# EAGLE design ospi_v14 (EAGLE 6.5.0)
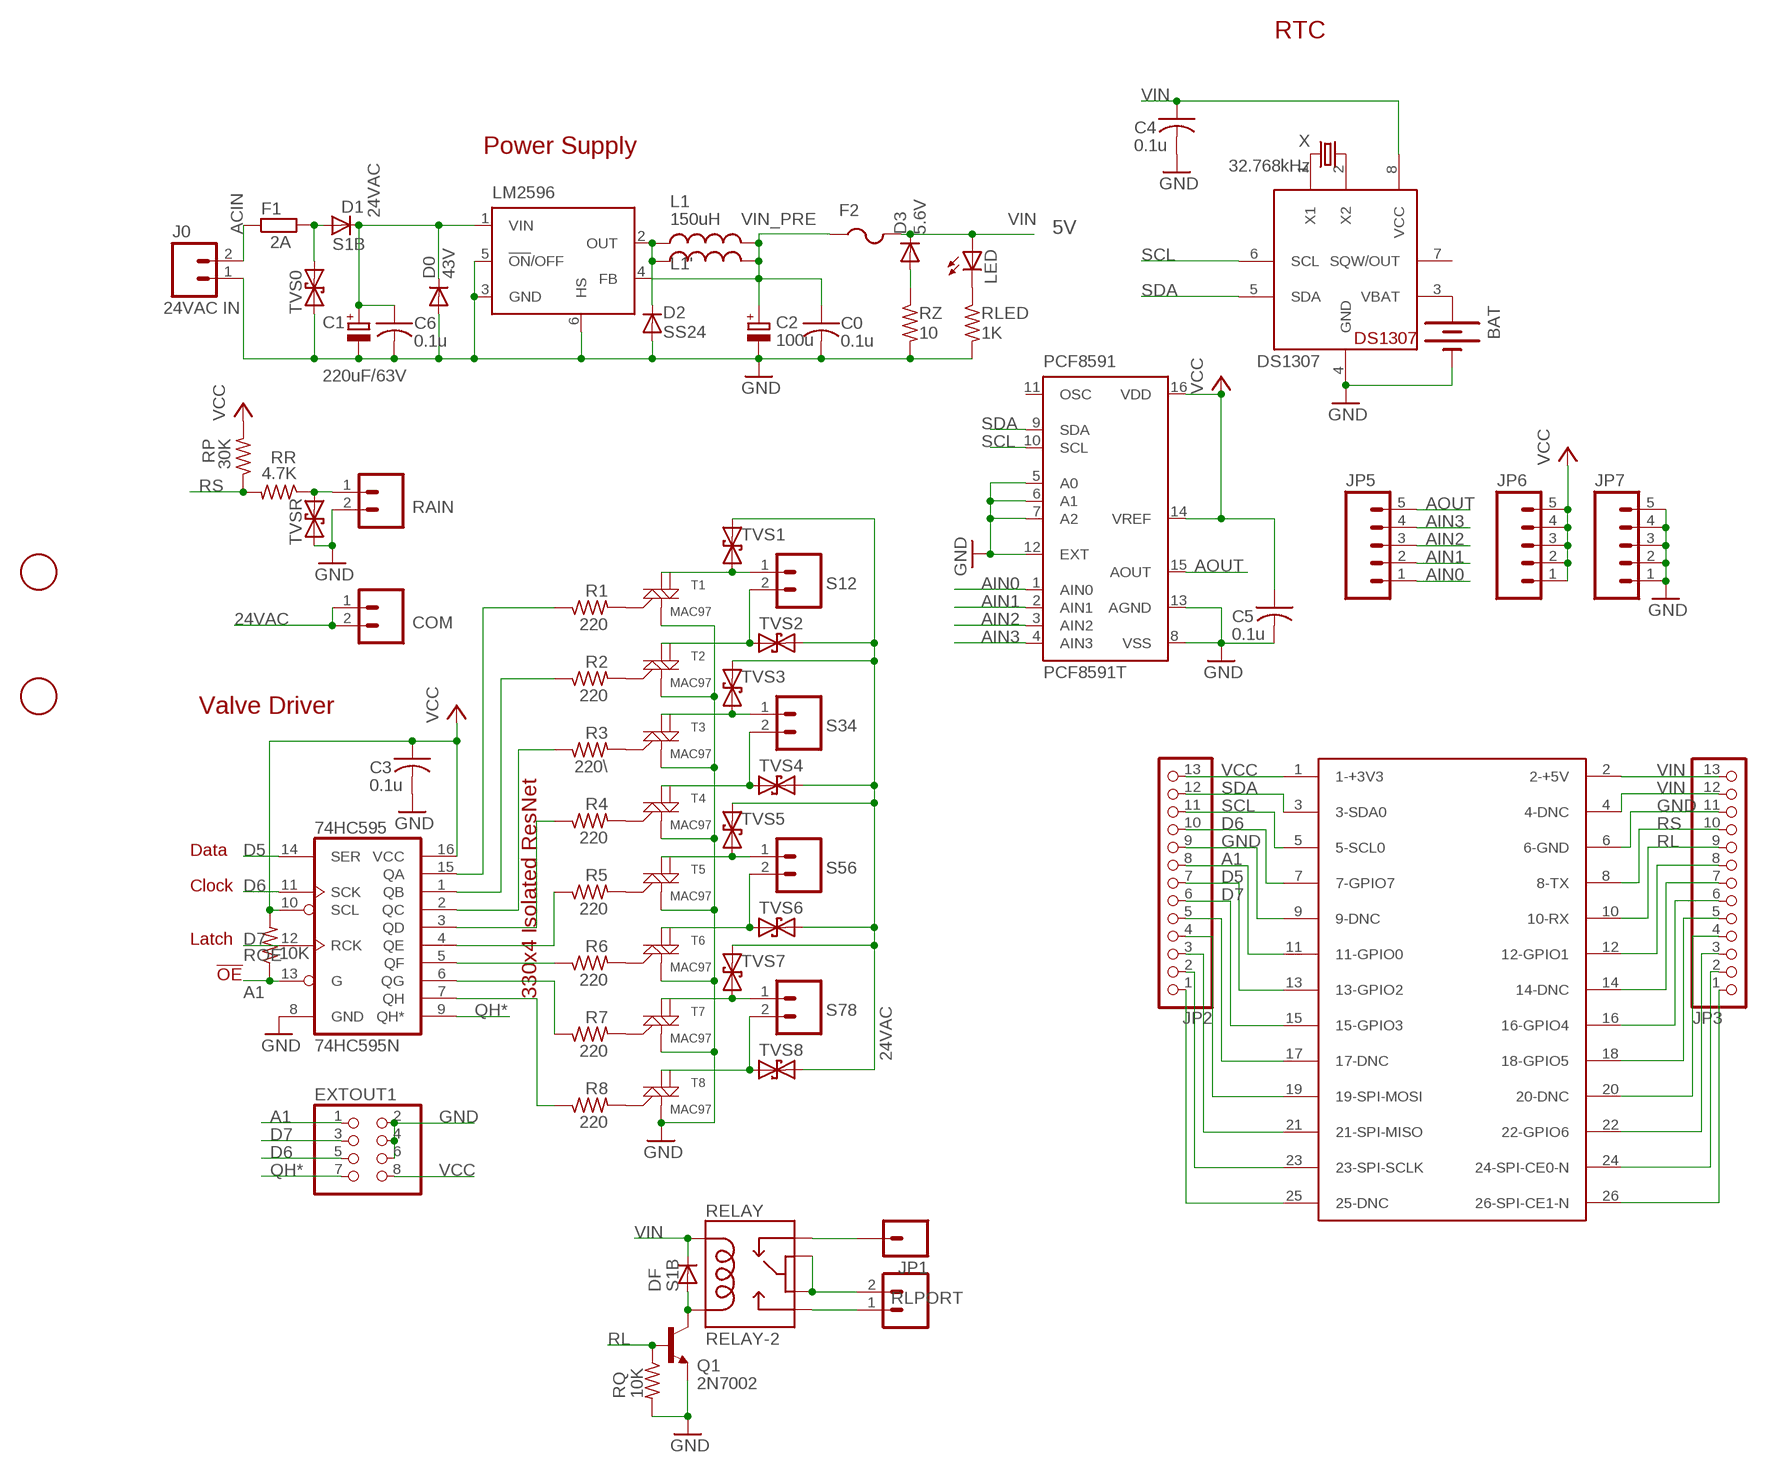
[diagram p0: schematic, sheet 1]

## Parts
74HC595  74HC595N  74LS595D  [SO16]
BAT  BATTERYBATTERY_12MM_SMT  [BATTCON_12MM_SMT]
C0  0.1u  C-USC0805K  [C0805K]
C1  220uF/63V  CPOL-EUE5-10.5  [E5-10,5]
C2  100u  CPOL-EUE3.5-8  [E3,5-8]
C3  0.1u  C-USC0805K  [C0805K]
C4  0.1u  C-USC0805K  [C0805K]
C5  0.1u  C-USC0805K  [C0805K]
C6  0.1u  C-USC0805K  [C0805K]
COM  M025MM-X  [SCREWTERMINAL-5MM-2-X]
D0  43V  DIODE-MINIMELF  [MINIMELF]
D1  S1B  DIODE-DO-214AC  [DO-214AC]
D2  SS24  DIODE-SMB  [SMB]
D3  5.6V  DIODE-MINIMELF  [MINIMELF]
DF  S1B  DIODE-DO-214AC  [DO-214AC]
DS1307  DS1307  DS1307SOIC  [SO08]
EXTOUT1  PINHD-2X4/90  [2X04/90]
F1  2A  R-EU_0411/3V  [0411V]
F2  PTCFUSE-1812  [1812]
J0  24VAC IN  M024MM-X  [SCREWTERMINAL-4MM-2-X]
JP1  M01PTH  [1X01]
JP2  PINHD-1X13_BIG  [1X13-BIG]
JP3  PINHD-1X13_BIG  [1X13-BIG]
JP5  M05LOCK  [1X05_LOCK]
JP6  M05LOCK  [1X05_LOCK]
JP7  M05LOCK  [1X05_LOCK]
L1  150uH  INDUCTORPWR  [CDRH125]
L1'  150uH  L-US0207/7  [0207/7]
LED  LEDCHIPLED_0805  [CHIPLED_0805]
LM2596  LM2596S  [TO263-5]
PCF8591  PCF8591T  [SO16W]
Q1  2N7002  TRANSISTOR_NPNSOT23-3  [SOT23-3]
R1  220  R-US_R0805  [R0805]
R2  220  R-US_R0805  [R0805]
R3  220\  R-US_R0805  [R0805]
R4  220  R-US_R0805  [R0805]
R5  220  R-US_R0805  [R0805]
R6  220  R-US_R0805  [R0805]
R7  220  R-US_R0805  [R0805]
R8  220  R-US_R0805  [R0805]
RAIN  M025MM-X  [SCREWTERMINAL-5MM-2-X]
RELAY  RELAY-2  [RELAY-HK4100F]
RLED  1K  R-US_R0805  [R0805]
RLPORT  M025MM  [SCREWTERMINAL-5MM-2]
ROE  10K  R-US_R0805  [R0805]
RP  30K  R-US_R0805  [R0805]
RQ  10K  R-US_R0805  [R0805]
RR  4.7K  R-US_R0805  [R0805]
RZ  10  R-US_R0805  [R0805]
S12  M025MM-X  [SCREWTERMINAL-5MM-2-X]
S34  M025MM-X  [SCREWTERMINAL-5MM-2-X]
S56  M025MM-X  [SCREWTERMINAL-5MM-2-X]
S78  M025MM-X  [SCREWTERMINAL-5MM-2-X]
T1  MAC97  MAC97SOT223  [SOT223]
T2  MAC97  MAC97SOT223  [SOT223]
T3  MAC97  MAC97SOT223  [SOT223]
T4  MAC97  MAC97SOT223  [SOT223]
T5  MAC97  MAC97SOT223  [SOT223]
T6  MAC97  MAC97SOT223  [SOT223]
T7  MAC97  MAC97SOT223  [SOT223]
T8  MAC97  MAC97SOT223  [SOT223]
TVS0  TVSSMB  [SMB]
TVS1  TVSSMB  [SMB]
TVS2  TVSSMB  [SMB]
TVS3  TVSSMB  [SMB]
TVS4  TVSSMB  [SMB]
TVS5  TVSSMB  [SMB]
TVS6  TVSSMB  [SMB]
TVS7  TVSSMB  [SMB]
TVS8  TVSSMB  [SMB]
TVSR  TVSSMB  [SMB]
U$1  FIDUCIAL  [FIDUCIAL_1MM]
U$2  RASPBERRY-PI  [RASPBERRY-PI]
U$3  FIDUCIAL  [FIDUCIAL_1MM]
X  32.768kHz  CRYSTALTC38H  [TC38H]

## Nets
24VAC [power]: COM.1 COM.2 D1.A F1.2 TVS0.C TVS1.C TVS2.C TVS3.C TVS4.C TVS5.C TVS6.C TVS7.C TVS8.C
A1: 74HC595.13(G) EXTOUT1.1 JP2.8 ROE.1 U$2.11(11-GPIO0)
ACIN [power]: F1.1 J0.2
AIN0: JP5.1 PCF8591.1(AIN0)
AIN1: JP5.2 PCF8591.2(AIN1)
AIN2: JP5.3 PCF8591.3(AIN2)
AIN3: JP5.4 PCF8591.4(AIN3)
AOUT: JP5.5 PCF8591.15(AOUT)
CO [relay power]: RELAY.5 RELAY.6 RLPORT.2
D5: 74HC595.14(SER) JP2.7 U$2.13(13-GPIO2)
D6: 74HC595.11(SCK) EXTOUT1.5 JP2.10 U$2.7(7-GPIO7)
D7: 74HC595.12(RCK) EXTOUT1.3 JP2.6 U$2.15(15-GPIO3)
GND [power]: 74HC595.8(GND) BAT.P$1(-) C0.2 C1.- C2.- C3.2 C4.2 C5.2 C6.2 D0.A D2.A DS1307.4(GND) EXTOUT1.2 EXTOUT1.4 EXTOUT1.6 J0.1 JP2.9 JP3.11 JP7.1 JP7.2 JP7.3 JP7.4 JP7.5 LM2596.3(GND) LM2596.5(!ON!/OFF) LM2596.6(HS) PCF8591.5(A0) PCF8591.6(A1) PCF8591.7(A2) PCF8591.8(VSS) PCF8591.12(EXT) PCF8591.13(AGND) Q1.2(E) RAIN.2 RLED.2 RQ.2 RZ.2 T1.1(M1) T2.1(M1) T3.1(M1) T4.1(M1) T5.1(M1) T6.1(M1) T7.1(M1) T8.1(M1) TVS0.A TVSR.A U$2.6(6-GND) U$2.9(9-DNC)
N$1: LED.C RLED.1
N$2 [power]: C1.+ C6.1 D0.C D1.C LM2596.1(VIN)
N$3: R1.2 T1.3(G)
N$4: 74HC595.5(QF) R6.1
N$5: 74HC595.6(QG) R7.1
N$6: D3.A RZ.1
N$7: 74HC595.7(QH) R8.1
N$8 [power]: D2.C L1'.1 L1.1 LM2596.2(OUT)
N$9: DS1307.1(X1) X.2
N$10: 74HC595.4(QE) R5.1
N$11: 74HC595.3(QD) R4.1
N$12: 74HC595.2(QC) R3.1
N$13: 74HC595.1(QB) R2.1
N$14: 74HC595.15(QA) R1.1
N$15: R2.2 T2.3(G)
N$16 [power]: S12.1 T1.2(M2) TVS1.A
N$17 [power]: S12.2 T2.2(M2) TVS2.A
N$18 [power]: S34.1 T3.2(M2) TVS3.A
N$19: R3.2 T3.3(G)
N$20 [power]: S34.2 T4.2(M2) TVS4.A
N$21: R4.2 T4.3(G)
N$22 [power]: S56.1 T5.2(M2) TVS5.A
N$23 [power]: S56.2 T6.2(M2) TVS6.A
N$24 [power]: S78.1 T7.2(M2) TVS7.A
N$25 [power]: S78.2 T8.2(M2) TVS8.A
N$26: R5.2 T5.3(G)
N$27: R6.2 T6.3(G)
N$28: R7.2 T7.3(G)
N$29: R8.2 T8.3(G)
N$30: DS1307.2(X2) X.1
N$31: RAIN.1 RR.1 TVSR.C
N$36: BAT.P$2(+) DS1307.3(VBAT)
N$37: JP3.8 U$2.12(12-GPIO1)
N$38: JP3.7 U$2.14(14-DNC)
N$39: JP3.6 U$2.16(16-GPIO4)
N$40: JP2.5 U$2.17(17-DNC)
N$41: JP2.4 U$2.19(19-SPI-MOSI)
N$42: JP2.3 U$2.21(21-SPI-MISO)
N$43: JP2.2 U$2.23(23-SPI-SCLK)
N$44: JP2.1 U$2.25(25-DNC)
N$45: JP3.5 U$2.18(18-GPIO5)
N$46: JP3.4 U$2.20(20-DNC)
N$47: JP3.3 U$2.22(22-GPIO6)
N$48: JP3.2 U$2.24(24-SPI-CE0-N)
N$49: JP3.1 U$2.26(26-SPI-CE1-N)
N$77 [power]: DF.A Q1.3(C) RELAY.9
NC [relay power]: JP1.1 RELAY.1
NO [relay power]: RELAY.10 RLPORT.1
QH*: 74HC595.9(QH*) EXTOUT1.7
RL: JP3.9 Q1.1(B) RQ.1 U$2.10(10-RX)
RS: JP3.10 RP.1 RR.2 U$2.8(8-TX)
SCL: DS1307.6(SCL) JP2.11 PCF8591.10(SCL) U$2.5(5-SCL0)
SDA: DS1307.5(SDA) JP2.12 PCF8591.9(SDA) U$2.3(3-SDA0)
VCC: 74HC595.10(SCL) 74HC595.16(VCC) C3.1 C5.1 EXTOUT1.8 JP2.13 JP6.1 JP6.2 JP6.3 JP6.4 JP6.5 PCF8591.14(VREF) PCF8591.16(VDD) ROE.2 RP.2 U$2.1(1-+3V3)
VIN [power]: C4.1 D3.C DF.C DS1307.8(VCC) F2.2 JP3.12 JP3.13 LED.A RELAY.2 U$2.2(2-+5V) U$2.4(4-DNC)
VIN_PRE [power]: C0.1 C2.+ F2.1 L1'.2 L1.2 LM2596.4(FB)
Unconnected: DS1307.7(SQW/OUT) PCF8591.11(OSC) T1.4(M2-4) T2.4(M2-4) T3.4(M2-4) T4.4(M2-4) T5.4(M2-4) T6.4(M2-4) T7.4(M2-4) T8.4(M2-4)

## Notes on the sheet
- RTC
- Power Supply
- 5V
- Valve Driver
- Data
- Clock
- Latch
- !OE
- 330x4 Isolated ResNet

## Library data of the parts
74HC595 = SparkFun:74*595: 8-bit SHIFT REGISTER, output latch
BAT = SparkFunNew:BATTERY: Battery Holders Various common sizes : AA, AAA, 20mm coin cell and 12mm coin cell.
C0 C3-C6 = adafruit:C-US: CAPACITOR, American symbol
C1 C2 = resistor:CPOL-EU: POLARIZED CAPACITOR, European symbol
COM J0 RAIN RLPORT S12 S34 S56 S78 = SparkFun:M02: Header 2 Standard 2-pin 0.1" header. Use with straight break away headers (SKU : PRT-00116), right angle break away headers (PRT-00553), swiss pins (PRT-00743), machine pins (PRT-00117), and female headers (PRT-00115). Molex polarized connector foot print use with SKU : PRT-08233 with associated crimp pins and housings.
D0 D1-D3 DF = diode:DIODE-: DIODE
DS1307 = adafruit:DS1307: DS1307 Real time clock (RTC) with battery backup ability. Talk to it via i2c
EXTOUT1 = pinhead:PINHD-2X4: PIN HEADER
F1 = rcl:R-EU_: RESISTOR, European symbol
F2 = adafruit:PTCFUSE: PTC fuses, resettable thermistors
JP1 = SparkFun:M01: Header 1 Standard 1-pin 0.1" header. Use with straight break away headers (SKU : PRT-00116), right angle break away headers (PRT-00553), swiss pins (PRT-00743), machine pins (PRT-00117), and female headers (PRT-00115).
JP2 JP3 = adafruit2013:PINHD-1X13: PIN HEADER
JP5-JP7 = SparkFun:M05: Header 5 Standard 5-pin 0.1" header. Use with straight break away headers (SKU : PRT-00116), right angle break away headers (PRT-00553), swiss pins (PRT-00743), machine pins (PRT-00117), and female headers (PRT-00115). Molex polarized connector foot print use with SKU : PRT-08230 with associated crimp pins and housings.
L1 = SparkFunNew:INDUCTOR: Inductors Basic Inductor/Choke - 0603 and 1206. Footprints are not proven and vary greatly between part numbers.
L1' = rcl:L-US: INDUCTOR, American symbol
LED = adafruit:LED: LED OSRAM: - CHIPLED LG R971, LG N971, LY N971, LG Q971, LY Q971, LO R971, LY R971 LH N974, LH R974 LS Q976, LO Q976, LY Q976 LO Q996 - Hyper CHIPLED LW Q18S LB Q993, LB Q99A, LB R99A - SideLED LS A670, LO A670, LY A670, LG A670, LP A670 LB A673, LV A673, LT A673, LW A673 LH A674 LY A675 LS A676, LA A676, LO A676, LY A676, LW A676 LS A679, LY A679, LG A679 - Hyper Micro SIDELED® LS Y876, LA Y876, LO Y876, LY Y876 LT Y87S - SmartLED LW L88C, LW L88S LB L89C, LB L89S, LG L890 LS L89K, LO L89K, LY L89K LS L896, LA L896, LO L896, LY L896 - TOPLED LS T670, LO T670, LY T670, LG T670, LP T670 LSG T670, LSP T670, LSY T670, LOP T670, LYG T670 LG T671, LOG T671, LSG T671 LB T673, LV T673, LT T673, LW T673 LH T674 LS T676, LA T676, LO T676, LY T676, LB T676, LH T676, LSB T676, LW T676 LB T67C, LV T67C, LT T67C, LS T67K, LO T67K, LY T67K, LW E67C LS E67B, LA E67B, LO E67B, LY E67B, LB E67C, LV E67C, LT E67C LW T67C LS T679, LY T679, LG T679 LS T770, LO T770, LY T770, LG T770, LP T770 LB T773, LV T773, LT T773, LW T773 LH T774 LS E675, LA E675, LY E675, LS T675 LS T776, LA T776, LO T776, LY T776, LB T776 LHGB T686 LT T68C, LB T68C - Hyper Mini TOPLED® LB M676 - Mini TOPLED Santana® LG M470 LS M47K, LO M47K, LY M47K Source: http://www.osram.convergy.de/
LM2596 = national-semiconductor:LM2596: SIMPLE SWITCHER® Power Converter 150 kHz 3A Step-Down Voltage Regulator Source: http://www.national.com/ds/LM/LM2596.pdf; MF: NATIONAL SEMICONDUCTOR; MPN: LM2596S-ADJ/NOPB; OC_FARNELL: 9494367; OC_NEWARK: 41K3842
PCF8591 = micro-philips:PCF8591: I2C-Bus D/A CONVERTER; MPN: PCF8591T/2,512; OC_FARNELL: 1826767; OC_NEWARK: 70R6911
Q1 = SparkFunNew:TRANSISTOR_NPN: Transistor NPN BJT configuration in SOT23 package. MMBT2222 is the common NPN we use. Double check BCE configuration again layout.
R1-R8 RLED ROE RP RQ RR RZ = adafruit2013:R-US_: RESISTOR, American symbol
RELAY = SparkFunNew:RELAY-2
T1-T8 = SparkFun:MAC97: MAC97 Triac http://www.onsemi.com/pub_link/Collateral/MAC97-D.PDF
TVS0 TVS1-TVS8 TVSR = SparkFunNew:TVS
U$1 U$3 = adafruitGood:FIDUCIAL: For use by pick and place machines to calibrate the vision/machine, 1mm By microbuilder.eu
U$2 = RaspberryPi:RASPBERRY-PI: Raspberry Pi Board <http://www.raspberrypi.org/> Jacques Lagnel V1.0 (beta) 2012 Board dimension: Forum 3D model <http://www.raspberrypi.org/forum/general-discussion/mechanical-profile-3d-models?value=3d%20model&type=1&include=1&search=1&ret=all> The GPIO Connector (P1): http://elinux.org/RPi_Low-level_peripherals
X = crystal:CRYSTAL: CRYSTAL; OC_FARNELL: unknown; OC_NEWARK: unknown

## Net classes
0 default: width 0.203 mm, clearance 0.203 mm
1 power: width 0.305 mm, clearance 0.254 mm
2 relay power: width 0.406 mm, clearance 0.254 mm

## Board
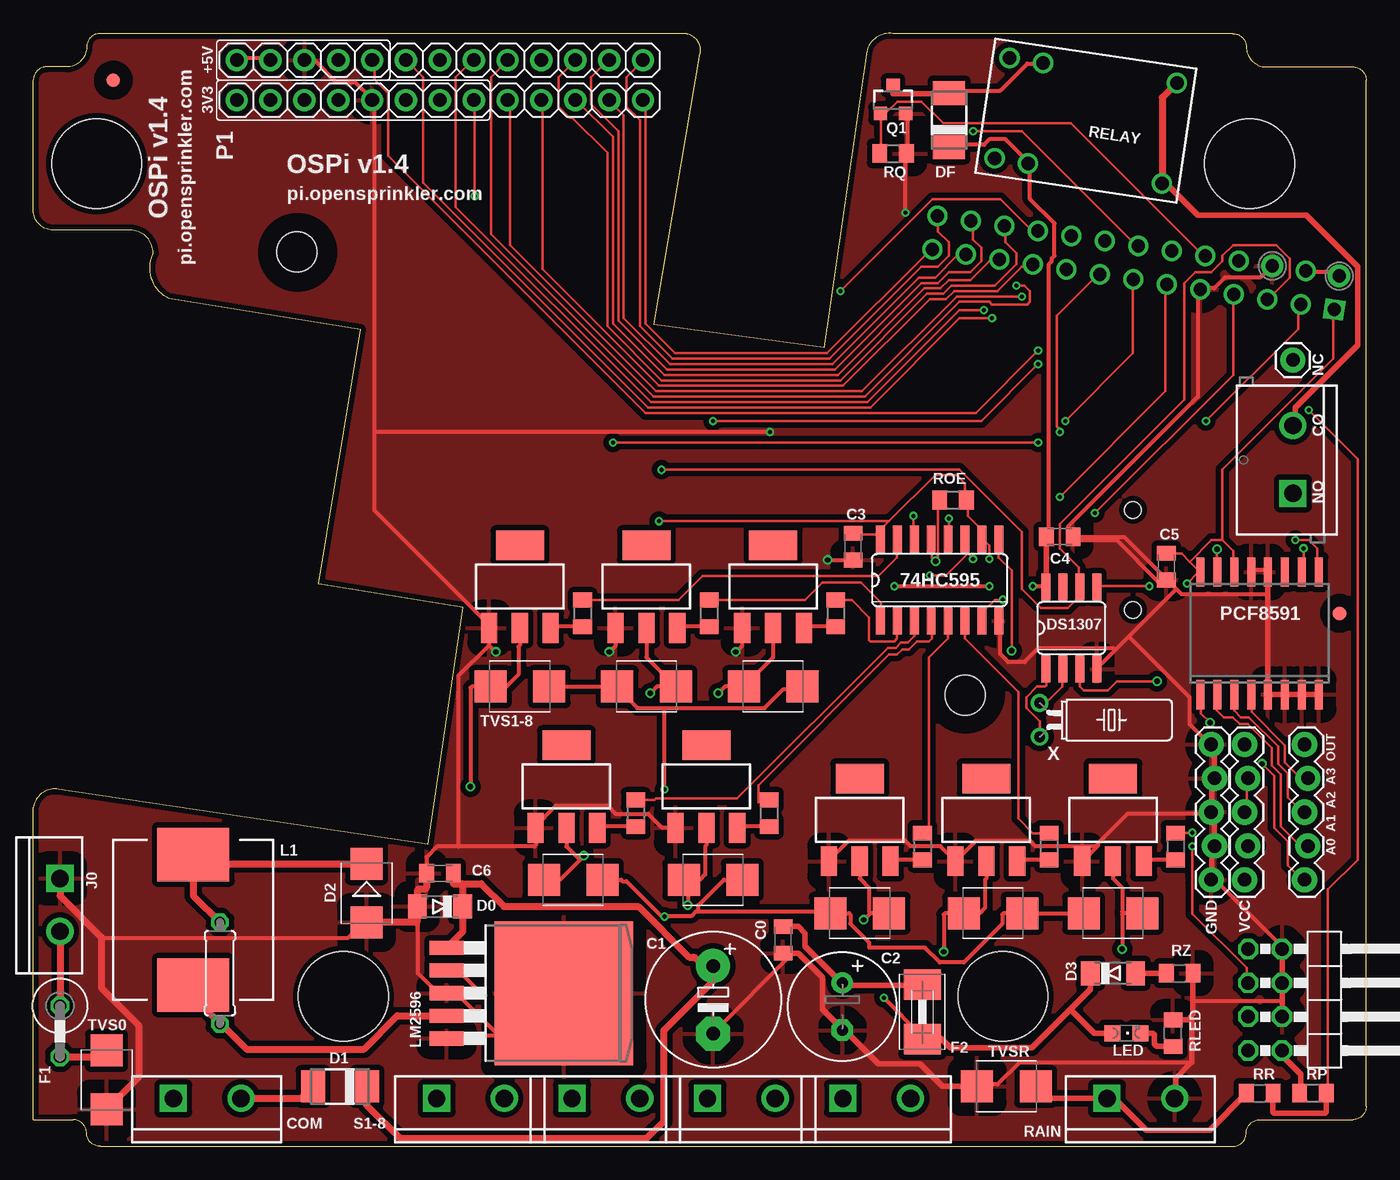
[diagram p1: board, top side]
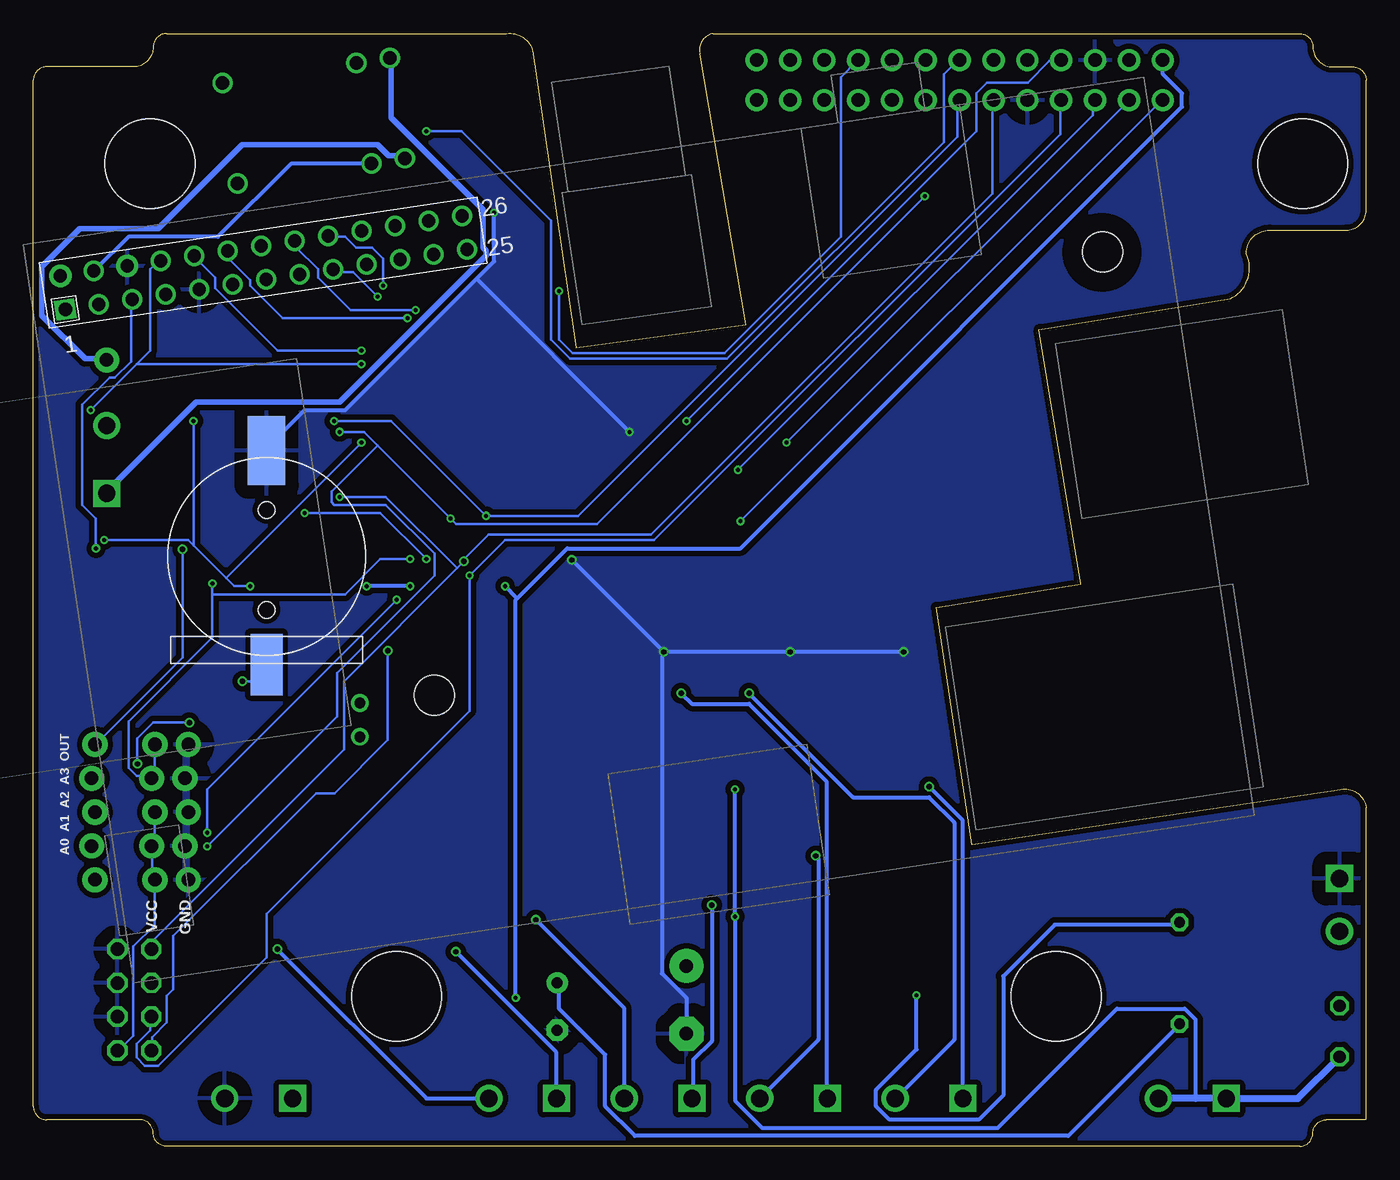
[diagram p2: board, bottom side, seen from below]

Size 100 x 83.52 mm. Coordinates in mm from the lower left corner, seen from the top.
Outline: 90,83.5 64.5,83.5 arc90 62.5,82 59.3,59.95 46.55,61.65 50,82 arc90 49,83.5 5,83.5 arc90 4,82.5 arc-90 2.5,81 1,81 arc90 0,80 0,70.25 arc90 1.5,68.75 7.25,68.75 arc-90 9,67 arc90 10.2,63.6 24.55,61.3 21.4,42.2 32.25,40.45 29.6,22.65 1.9,26.8 arc90 0,25.45 0,2 3,2 arc-90 4,1 arc90 5,0 90,0 arc90 91,1 arc-90 92,2 99,2 arc90 100,3 100,80 arc90 99,81 92.5,81 arc-90 91,82.5 arc90 90,83.5
Copper layers (1*16): Top 0.035mm / dielectric 1.5mm / Bottom 0.035mm
Design rules "Fusion_eagle_rule_v1.1 *": minimum track width 6mil, minimum drill 12mil, track to track 6mil, track to pad 6mil, pad to pad 6mil, via to via 6mil, smd to smd 0mil, copper to edge 10mil, drill to drill 10mil, minimum pad ring 10mil, minimum via ring 6mil, stop-mask expansion 2mil, vias tented up to drill 100mil, thermal gap 40mil
Holes 6.75 mm at 4.76,73.74 91.24,73.74 23.26,11.26 72.74,11.26
tRestrict: area 67.4,31.4 to 72.5,36.5; area 17.3,64.5 to 22.4,69.6
bRestrict: area 17.3,64.5 to 22.4,69.6; area 67.4,31.4 to 72.5,36.5
vRestrict: area 12.5,77.5 to 13.5,82.5; area 96,58 to 97,59.5; area 97,19 to 98,30.5; area 96,53.5 to 97,55; area 96,48.5 to 97,50

### Footprints (pad centres in the part's own frame; a part is rotated, then mirrored left to right if it is on the bottom)
SO16 = smd 0.66 x 2.032: 1 -4.445,-3.073; 2 -3.175,-3.073; 3 -1.905,-3.073; 4 -0.635,-3.073; 5 0.635,-3.073; 6 1.905,-3.073; 7 3.175,-3.073; 8 4.445,-3.073; 9 4.445,3.073; 10 3.175,3.073; 11 1.905,3.073; 12 0.635,3.073; 13 -0.635,3.073; 14 -1.905,3.073; 15 -3.175,3.073; 16 -4.445,3.073
BATTCON_12MM_SMT = smd 2.8 x 5.2: P$1 0,11.96 | smd 2.4 x 4.6: P$2 0,-4.1 | hole 1.25: 0,7.5; 0,0
C0805K = smd 1.1 x 1.4: 1 -1,0; 2 1,0
E5-10,5 = drill 1.016 pad 2.54: + -2.54,0 | drill 1.016 pad 2.54 octagon: - 2.54,0
E3,5-8 = drill 0.813 pad 1.6: + -1.778,0 | drill 0.813 pad 1.6 octagon: - 1.778,0
SCREWTERMINAL-5MM-2-X = drill 1.3 pad 2.032 square: 1 0,0 | drill 1.3 pad 2.032: 2 5.08,0
MINIMELF = smd 1.4 x 1.8: A 1.7,0; C -1.7,0
DO-214AC = smd 1.8 x 2.4: A 2.025,0; C -2.025,0
SMB = smd 2.4 x 2.4: A 2.2,0; C -2.2,0
SO08 = smd 0.66 x 2.032: 1 -1.905,-3.073; 2 -0.635,-3.073; 3 0.635,-3.073; 4 1.905,-3.073; 5 1.905,3.073; 6 0.635,3.073; 7 -0.635,3.073; 8 -1.905,3.073
2X04/90 = drill 1.016 octagon: 1 -3.81,-6.35; 2 -3.81,-3.81; 3 -1.27,-6.35; 4 -1.27,-3.81; 5 1.27,-6.35; 6 1.27,-3.81; 7 3.81,-6.35; 8 3.81,-3.81
0411V = drill 0.914 octagon: 1 -2.54,0; 2 1.27,0
1812 = smd 2.286 x 2.794: 1 -2.046,0; 2 2.046,0
SCREWTERMINAL-4MM-2-X = drill 1.3 pad 2.032 square: 1 0,0 | drill 1.3 pad 2.032: 2 3.96,0
1X01 = drill 1.016 pad 1.88: 1 0,0
1X13-BIG = drill 1.016 pad 1.676: 1 -15.24,0; 2 -12.7,0; 3 -10.16,0; 4 -7.62,0; 5 -5.08,0; 6 -2.54,0; 7 0,0; 8 2.54,0; 9 5.08,0; 10 7.62,0; 11 10.16,0; 12 12.7,0; 13 15.24,0
1X05_LOCK = drill 1.016 pad 1.88: 1 0,0.127; 2 2.54,-0.127; 3 5.08,0.127; 4 7.62,-0.127; 5 10.16,0.127
CDRH125 = smd 5.4 x 4: 1 0,4.9; 2 0,-4.9
0207/7 = drill 0.813 octagon: 1 -3.81,0; 2 3.81,0
CHIPLED_0805 = smd 1.2 x 1.2: A 0,-1.05; C 0,1.05
TO263-5 = smd 1.067 x 2.54: 1 -3.404,-5.791; 2 -1.702,-5.791; 3 0,-5.791; 4 1.702,-5.791; 5 3.404,-5.791 | smd 10.8 x 10.41: 6 0,3
SO16W = smd 0.6 x 2.2: 1 -4.445,-4.6; 2 -3.175,-4.6; 3 -1.905,-4.6; 4 -0.635,-4.6; 5 0.635,-4.6; 6 1.905,-4.6; 7 3.175,-4.6; 8 4.445,-4.6; 9 4.445,4.6; 10 3.175,4.6; 11 1.905,4.6; 12 0.635,4.6; 13 -0.635,4.6; 14 -1.905,4.6; 15 -3.175,4.6; 16 -4.445,4.6
SOT23-3 = smd 1 x 1: 1 -0.95,-1; 2 0.95,-1; 3 0,1.1
R0805 = smd 1.1 x 1.4: 1 -1,0; 2 1,0
RELAY-HK4100F = drill 1.016: 1 12.7,7.62; 2 10.16,7.62; 5 0,7.62; 6 0,0; 9 10.16,0; 10 12.7,0
SCREWTERMINAL-5MM-2 = drill 1.3 pad 2.032 square: 1 0,0 | drill 1.3 pad 2.032: 2 5.08,0
SOT223 = smd 1.219 x 2.235: 1 -2.311,-3.099; 2 0,-3.099; 3 2.311,-3.099 | smd 3.6 x 2.2: 4 0,3.099
FIDUCIAL_1MM = smd 1 x 1: 1 0,0
RASPBERRY-PI = drill 1 square: 1 0,0 | drill 1 pad 1.676: 2 0,2.54; 6 5.08,2.54 | drill 1: 3 2.54,0; 4 2.54,2.54; 5 5.08,0; 7 7.62,0; 8 7.62,2.54; 9 10.16,0; 10 10.16,2.54; 11 12.7,0; 12 12.7,2.54; 13 15.24,0; 14 15.24,2.54; 15 17.78,0; 16 17.78,2.54; 17 20.32,0; 18 20.32,2.54; 19 22.86,0; 20 22.86,2.54; 21 25.4,0; 22 25.4,2.54; 23 27.94,0; 24 27.94,2.54; 25 30.48,0; 26 30.48,2.54 | hole 3: 23.1,-32.725; 77.6,-7.225
TC38H = drill 0.813: 1 -1.27,0; 2 1.27,0

### Placement (x,y rotation side)
74HC595  68,42.5 0 top
BAT  82.5,40.25 0 bottom
C0  56.25,15.5 270 top
C1  51,11 270 top
C2  60.7,10.5 270 top
C3  61.5,45 270 top
C4  77,45.75 0 top
C5  85,43.5 270 top
C6  30.5,20.5 180 top
COM  10.5,3.6 0 top
D0  30.5,18 180 top
D1  23,4.5 180 top
D2  25,19 270 top
D3  81,13 0 top
DF  68.7,77 90 top
DS1307  77.88,38.9 0 top
EXTOUT1  97.5,11 270 top
F1  2,8 270 top
F2  66.7,10.1 270 top
J0  2,20.1 270 top
JP1  94.5,59 0 top
JP2  30.5,78.5 180 top
JP3  30.5,81.5 180 top
JP5  95.5,20 90 top
JP6  91,20 90 top
JP7  88.5,20 90 top
L1  12,17 0 top
L1'  14,13 270 top
LED  82,8.5 270 top
LM2596  36.8,11.5 270 top
PCF8591  92,38.5 0 top
Q1  64.5,78.5 0 top
R1  41.2,40 270 top
R2  50.7,40 270 top
R3  60.2,40 270 top
R4  45.2,25 270 top
R5  55.2,25 270 top
R6  66.7,22.5 270 top
R7  76.2,22.5 270 top
R8  85.7,22.5 270 top
RAIN  80.55,3.6 0 top
RELAY  85.8,79.8 171.5 top
RLED  85.5,8.5 90 top
RLPORT  94.5,49 90 top
ROE  69,48.5 0 top
RP  96,4 180 top
RQ  64.5,74.5 0 top
RR  92,4 0 top
RZ  86,13 0 top
S12  30.26,3.6 0 top
S34  40.42,3.6 0 top
S56  50.58,3.6 0 top
S78  60.74,3.6 0 top
T1  36.5,42 0 top
T2  46,42 0 top
T3  55.5,42 0 top
T4  40,27 0 top
T5  50.5,27 0 top
T6  62,24.5 0 top
T7  71.5,24.5 0 top
T8  81,24.5 0 top
TVS0  5.5,5 270 top
TVS1  36.5,34.5 180 top
TVS2  46,34.5 0 top
TVS3  55.5,34.5 180 top
TVS4  40.5,20 180 top
TVS5  51,20 180 top
TVS6  62,17.5 0 top
TVS7  72,17.5 180 top
TVS8  81,17.5 0 top
TVSR  73,4.5 180 top
U$1  6,80 0 top
U$2  97.6,62.8 8.5 bottom
U$3  98,40 0 top
X  75.5,32 270 top

### Tracks (layer width: path | path; a pad name or v marks a point on that pad's centre or on a via)
24VAC  (via drill 0.3)
  Top 0.305: TVS1.C TVS2.C 43.89,34.31 45.31,32.89 47.35,32.89 | TVS5.C 51.8,20 49.9,18.1 49.9,17.8 49.77,17.66 | 49.77,17.66 49.4,17.3 47.35,17.3 | 47.35,17.3 47.1,17.3 44.5,19.9 44.2,19.9 44.1,20 TVS4.C | TVS8.C TVS7.C 72.8,17.5 72.7,17.4 72.7,16.7 69.8,13.8 68,13.8 66.9,14.9 62.7,14.9 62.7,15.3 61.3,16.7 61.3,17.4 61.2,17.5 TVS6.C 59.74,17.65 49.78,17.65 49.77,17.66 | v47.35,17.24 47.35,17.3 | 47.35,32.89 54.86,32.89 56.29,34.31 57.51,34.31 TVS3.C | v47.35,26.79 47.35,32.89
  Top 0.508: F1.2 5.03,6.73 TVS0.C | COM.2 20.07,3.6 D1.A
  Bottom 0.305: 12.8,3.6 12.8,9.52 13.61,10.33 18.69,10.33 27.64,1.39 45.31,1.39 47.35,3.42 v47.35,17.24 v47.35,26.79
  Bottom 0.508: F1.2 5.13,3.6 COM.1 12.8,3.6 COM.2
A1  (via drill 0.3, 0.41)
  Top 0.203: 74HC595.13 67.4,45.5 67.4,44.2 v67.7,43.9 67.87,44.06 67.87,48.33 ROE.1 | v77.01,48.74 84.94,56.66 84.94,64.59 U$2.11
  Bottom 0.203: 68.21,43.39 v67.7,43.9 67.67,44.06 65.84,45.89 53.65,45.89 28.04,71.49 28.04,78.4 JP2.8 | 68.21,43.39 76.7,34.9 76.7,29.8 91.1,15.4 91.1,14.9 EXTOUT1.1 | v77.01,48.74 73.56,48.74 68.21,43.39
ACIN
  Top 0.508: J0.2 F1.1
AIN0  (via drill 0.41)
  Top 0.203: v88.3,31.8 87.6,32.5 87.6,33.9 PCF8591.1 | v92.2,28.7 93.1,27.8 93.1,23.9 94.1,22.9 94.1,21.1 95.2,20 JP5.1
  Bottom 0.203: v88.3,31.8 91,31.8 92.2,30.6 v92.2,28.7
AIN1
  Top 0.203: PCF8591.2 88.8,33.9 88.8,32.7 89.3,32.2 90,32.2 90.5,31.7 91.1,31.7 92.9,29.9 92.9,28.6 93.6,27.9 93.6,24 95,22.6 95.6,22.6 JP5.2
AIN2
  Top 0.203: PCF8591.3 90.1,32.7 90.6,32.2 91.2,32.2 93.4,30 93.4,28.7 94.1,28 94.1,26.2 95.3,25 JP5.3
AIN3
  Top 0.203: PCF8591.4 91.4,33.9 91.4,32.6 93.9,30.1 93.9,28.8 95,27.7 95.6,27.7 JP5.4
AOUT  (via drill 0.41)
  Top 0.203: v88.8,44.8 88.8,43.1 PCF8591.15
  Bottom 0.203: v88.8,44.8 88.8,36.7 95.3,30.2 JP5.5
CO
  Top 0.406: RLPORT.2 94.69,54.22 94.69,55.44 99.36,60.12 99.36,66.01 95.5,69.87 87.38,69.87 84.94,72.31 RELAY.5
  Top 0.508: RELAY.6 84.7,78.7 84.7,72.3 RELAY.5
D5  (via drill 0.3)
  Top 0.203: v66.04,47.31 66.04,45.69 74HC595.14 | v77.42,54.43 82.5,59.51 82.5,64.99 U$2.13
  Bottom 0.203: JP2.7 30.68,78.4 30.68,75.76 59.13,47.31 v66.04,47.31 73.15,54.43 v77.42,54.43
D6  (via drill 0.3)
  Top 0.203: 70.1,44.47 70.1,45.48 74HC595.11 | v70.51,44.06 70.1,44.47 | v79.65,47.52 90.02,57.88 90.02,63.77 U$2.7 | v67.26,42.84 68.48,42.84 70.1,44.47
  Bottom 0.203: v70.51,44.06 73.97,47.52 v79.65,47.52 | EXTOUT1.5 91.24,9.72 91.24,8.71 92.25,7.69 92.25,6.67 91.64,6.06 90.63,6.06 82.5,14.19 82.5,17.44 67.26,32.68 v67.26,42.84 64.62,45.48 53.44,45.48 22.96,75.97 22.96,78.4 JP2.10
D7  (via drill 0.3)
  Top 0.203: v68.68,47.11 68.68,45.69 74HC595.12 | v77.01,53.61 77.01,53.82 76.81,54.02 76.81,62.35 79.86,65.4 U$2.15 | v86.97,22.52 86.97,17.44 91.03,13.38 91.03,12.36 EXTOUT1.3 | v33.12,71.29 33.12,78.4 JP2.6
  Bottom 0.203: 74.17,52.6 75.18,53.61 v77.01,53.61 | 74.17,52.6 v68.68,47.11 68.28,46.7 57.71,46.7 v33.12,71.29 | v86.97,22.52 77.22,32.28 77.22,35.53 69.9,42.84 69.9,44.47 73.56,48.13 77.42,48.13 77.62,48.33 77.62,49.14 74.17,52.6
GND  (via drill 0.3, 0.41)
  Top 0.305: v43.2,37.1 43.7,37.6 T2.1 | 34.2,37.6 v34.7,37.1 | 34.2,37.6 T1.1 34.34,38.98 25.6,47.72 25.6,53.61 | v52.7,37.1 53.2,37.6 T3.1 | v59.6,44 C3.2 | C6.2 29.5,21.7 30.3,22.5 31.9,22.5 | 31.9,22.5 37.6,22.5 37.7,22.6 T4.1 37.59,23.95 39.22,25.57 43.08,25.57 43.69,24.96 46.13,24.96 47.14,23.95 48.16,23.95 T5.1 | 85.75,41.83 86.16,41.42 92.64,41.42 | 85.75,41.83 85.14,42.44 C5.2 | 85.75,41.83 82.19,38.27 | 82.19,38.27 81.18,37.26 | 81.18,37.26 79.86,35.93 DS1307.4 | 74HC595.8 72.54,39.39 72.54,36.95 73.15,36.34 74.37,36.34 75.39,37.36 81.08,37.36 81.18,37.26 | PCF8591.13 91.44,43.25 92.46,43.25 PCF8591.12 | C1.- 51,8.5 56.9,14.39 C0.2 | T6.1 59.74,21.51 61.16,22.93 65.43,22.93 65.84,22.52 68.07,22.52 69.09,21.51 T7.1 69.29,21.51 70.71,22.93 74.78,22.93 75.18,22.52 79.65,22.52 79.76,22.42 | 87,10.94 93.7,10.94 | 79.76,22.42 79.86,22.52 79.86,22.73 82.09,24.96 88.19,24.96 JP7.3 | 79.76,22.42 78.84,21.51 T8.1 | EXTOUT1.2 93.67,15.01 88.59,20.09 JP7.1 | TVSR.A 70.92,4.64 72.34,4.64 73.97,6.27 86.77,6.27 86.82,6.22 | 82.19,38.27 86.77,33.7 86.77,31.67 88.19,30.25 JP7.5 | JP3.11 20.52,81.45 21.13,81.45 22.76,79.83 24.18,79.83 25.4,78.61 JP2.9 25.6,78.4 25.6,53.61 | 34.95,8.3 36.58,8.3 39.62,11.35 LM2596.6 34.95,8.3 | 34.95,8.3 31.09,8.3 LM2596.5 | 34.95,8.3 31.9,11.35 31.09,11.35 LM2596.3 30.89,11.55 30.28,11.55 28.85,12.97 28.85,16.63 28.7,16.8 | 5.1,15.61 23.57,15.61 24.79,16.83 D2.A | 31.9,22.5 31.9,35.33 34.14,37.56 34.2,37.6 | C4.2 78.03,45.69 81.89,45.69 84.94,42.64 C5.2 | U$2.6 92.86,66.01 92.05,65.19 89.41,65.19 88.59,64.38 87.58,64.38 U$2.9 87.38,64.18 87.38,56.25 77.62,46.5 77.62,45.69 77.83,45.48 81.28,45.48 84.33,42.44 84.94,42.44 C5.2
  Top 0.305: Q1.2 65.63,77.39 65.63,74.54 RQ.2 65.43,74.34 v65.43,70.07 | v55.27,53.61 25.6,53.61
  Top 0.406: C0.2 57.4,14.5 59.2,12.7 59.2,10.3 60.7,8.8 C2.- 60.9,8.7 63.4,6.2 66.5,6.2 68.2,4.5 TVSR.A | 86.8,9.5 86.9,9.4 86.9,6.3 86.82,6.22 85.7,5.1 85.7,3.6 RAIN.2 | RLED.2 86.8,9.5 | RZ.2 87,10.94 87,9.9 86.8,9.7 86.8,9.5 | PCF8591.8 PCF8591.7 PCF8591.6 PCF8591.5 92.64,41.42 PCF8591.12 | EXTOUT1.2 93.7,12.3 EXTOUT1.4 93.7,12.1 93.7,10.94 93.7,9.8 EXTOUT1.6 | JP7.5 88.4,30.1 88.6,29.9 88.6,27.7 JP7.4 88.5,27.5 88.4,27.4 88.4,25.1 JP7.3 88.4,24.9 88.6,24.7 88.6,22.6 JP7.2 88.5,22.4 88.4,22.3 88.4,20 JP7.1
  Top 0.508: J0.1 2,18.8 5.1,15.7 5.1,15.61 5.1,11.9 7.9,9.1 7.9,5.2 TVS0.A | C6.2 29.5,19.4 29.4,19.3 28.9,19.3 28.8,19.2 D0.A 28.8,16.9 28.7,16.8 D2.A
  Bottom 0.305: v34.7,37.1 v43.2,37.1 v52.7,37.1 | v52.7,37.1 v59.6,44 | C1.- 51,8.5 51,11.14 52.83,12.97 52.83,36.95 v52.7,37.1 | v65.43,70.07 65.43,66.41 66.75,65.09 | 66.75,65.09 76.61,55.24 79.65,55.24 82.5,52.39 BAT.P$1 | 66.75,65.09 v55.27,53.61
  pour Top (isolate 0.406): 0,84 102,84 102,0 0,0
  pour Bottom (isolate 0.406): 0,84 100,84 100,0 0,0
N$1
  Top 0.406: RLED.1 84.3,7.5 84.1,7.7 84.1,8.4 84,8.5 LED.C
N$2
  Top 0.508: D1.C 25,4.5 25,3.1 27.5,0.6 46,0.6 47.3,1.9 47.3,8.7 51,12.4 C1.+ 50.8,13.6 50.2,13.6 49.7,14.1 49.5,14.2 49.2,14.2 45.4,18 35.3,18 33.6,19.7 32.2,19.7 | 32.2,19.7 31.5,19.7 C6.1 | 32.2,19.7 D0.C 32.2,16.09 LM2596.1
N$3
  Top 0.305: R1.2 38.91,39 T1.3
N$4
  Top 0.203: R6.1 67.2,23.5 67.2,36.7 68.6,38.1 68.6,39.4 74HC595.5
N$5
  Top 0.203: R7.1 75,23.5 73.9,24.6 73.9,34.1 69.9,38.1 69.9,39.4 74HC595.6
N$6
  Top 0.406: D3.A RZ.1
N$7  (via drill 0.3)
  Top 0.203: v86.97,23.54 85.75,23.54 R8.1 | v72.75,41.01 72.14,41.01 71.32,40.2 71.32,39.59 74HC595.7
  Bottom 0.203: v86.97,23.54 86.97,26.79 v72.75,41.01
N$8  (via drill 0.3)
  Top 0.305: v33.73,11.35 31.9,13.18 31.09,13.18 LM2596.2
  Top 0.508: L1'.1 12,18.81 L1.1 13.4,21.9 14.1,21.2 D2.C
  Bottom 0.305: v33.73,11.35 33.73,7.28 36.78,4.23 36.78,3.02 35.76,2 29.06,2 27.23,3.83 27.23,12.77 23.37,16.63 14.02,16.63 L1'.1
N$9
  Top 0.203: X.2 75.5,31.9 74.5,32.9 74.5,33.7 75.3,34.5 75.9,34.5 76,34.6 76,35.8 DS1307.1
N$10
  Top 0.203: 54.4,26 54.4,27.1 64.2,36.9 64.8,36.9 65.2,37.3 65.7,37.3 66.3,37.9 67.2,37.9 67.4,38.1 67.4,39.4 74HC595.4 | 54.4,26 54.4,25.8 | R5.1 54.4,26
N$11
  Top 0.203: R4.1 46.6,26 46.7,26.1 52.8,26.1 64.1,37.4 64.7,37.4 65.1,37.8 65.6,37.8 66.1,38.3 66.1,39.4 74HC595.3
N$12
  Top 0.203: R3.1 61.4,41 62.7,39.7 62.7,38 62.8,37.9 64.6,37.9 64.8,38.1 64.8,39.4 74HC595.2
N$13
  Top 0.203: R2.1 57.9,41 59.2,42.3 62.1,42.3 63.6,40.8 63.6,39.5 74HC595.1
N$14
  Top 0.203: R1.1 48.4,41 50.2,42.8 63.4,42.8 64.8,44.2 64.8,45.5 74HC595.15
N$15
  Top 0.305: R2.2 48.41,39 T2.3
N$16  (via drill 0.41)
  Top 0.305: T1.2 36.5,37.6 36.4,37.5 36.4,35.4 35.5,34.5 TVS1.A 32.9,34.5 32.8,34.4 v32.8,27
  Bottom 0.305: v32.8,27 30.3,24.5 30.3,3.6 S12.1
N$17  (via drill 0.41)
  Top 0.305: T2.2 46,36.7 TVS2.A 46.8,34.5 v46.3,34
  Bottom 0.305: v46.3,34 38.5,26.2 32.8,26.2 30.9,24.3 30.9,8 35.3,3.6 S12.2
N$18  (via drill 0.41)
  Top 0.305: T3.2 55.5,36.7 TVS3.A 51.9,34.5 v51.4,34
  Bottom 0.305: v51.4,34 50.6,33.2 46.3,33.2 40.5,27.4 40.5,3.6 S34.1
N$19
  Top 0.305: R3.2 57.91,39 T3.3
N$20  (via drill 0.41)
  Top 0.305: 41,21.5 39.5,20 TVS4.A | 41,21.5 v41.3,21.8 | 41,21.5 40,22.5 T4.2
  Bottom 0.305: S34.2 41.1,8 41.1,21.6 v41.3,21.8
N$21
  Top 0.305: R4.2 42.41,24 T4.3
N$22  (via drill 0.41)
  Top 0.305: v49.1,18.1 49.1,20 TVS5.A 50,20 50.4,20.4 50.4,22.5 50.5,22.6 T5.2
  Bottom 0.305: v49.1,18.1 49.1,7.9 50.5,6.5 50.5,3.6 S56.1
N$23  (via drill 0.41)
  Top 0.305: 62.8,17.5 v62.3,17 | TVS6.A 62.8,17.5 | T6.2 62,20.1 62.7,19.4 62.7,17.6 62.8,17.5
  Bottom 0.305: v62.3,17 55.7,10.4 55.7,3.6 S56.2
N$24  (via drill 0.41)
  Top 0.305: v68.3,14.6 68.3,17.4 68.4,17.5 TVS7.A 71,17.5 71.4,17.9 71.4,20 71.5,20.1 T7.2
  Bottom 0.305: v68.3,14.6 60.8,7.1 60.8,3.6 S78.1
N$25  (via drill 0.41)
  Top 0.305: v81.7,14.8 81.7,17.4 81.8,17.5 | TVS8.A 81.8,17.5 | T8.2 81,20.1 81.7,19.4 81.7,17.6 81.8,17.5
  Bottom 0.305: S78.2 70.5,3.6 v81.7,14.8
N$26
  Top 0.305: R5.2 52.91,24 T5.3
N$27
  Top 0.305: R6.2 64.41,21.5 T6.3
N$28
  Top 0.305: R7.2 73.91,21.5 T7.3
N$29
  Top 0.305: R8.2 83.41,21.5 T8.3
N$30
  Top 0.203: X.1 75.5,33.3 76,33.3 77.2,34.5 77.2,35.8 DS1307.2
N$31
  Top 0.406: TVSR.C 76.1,3.6 RAIN.1 81.1,3.6 83.5,1.2 88.25,1.2 RR.1
N$36  (via drill 0.41)
  Top 0.203: DS1307.3 78.5,35.8 78.5,34.5 78.8,34.2 80.6,34.2 81.3,34.9 v84.3,34.9
  Bottom 0.203: v84.3,34.9 82.6,34.9 82.5,35 BAT.P$2
N$37  (via drill 0.3)
  Top 0.203: v71.93,62.15 69.49,62.15 62.79,55.44 46.13,55.44 29.26,72.31 29.26,80.23 28.04,81.45 JP3.8
  Bottom 0.203: v71.93,62.15 81.28,62.15 83.72,64.59 83.72,64.99 85.34,66.62 85.34,67.02 U$2.12
N$38  (via drill 0.3)
  Top 0.203: v70.51,76.17 74.17,76.17 82.7,67.63 U$2.14
  Bottom 0.203: v70.51,76.17 67.87,76.17 61.16,69.46 61.16,60.52 59.74,59.1 47.95,59.1 31.7,75.36 31.7,80.44 30.68,81.45 JP3.7
N$39  (via drill 0.3)
  Top 0.203: v71.32,62.76 69.49,62.76 62.59,55.85 46.33,55.85 31.7,70.48 31.7,80.23 32.92,81.45 JP3.6
  Bottom 0.203: v71.32,62.76 76.2,62.76 78.64,65.19 78.64,65.81 80.26,67.43 80.26,67.84 U$2.16
N$40  (via drill 0.3)
  Top 0.203: v74.17,63.77 69.29,63.77 62.18,56.66 46.74,56.66 35.76,67.63 35.76,78.4 JP2.5
  Bottom 0.203: v74.17,63.77 76,65.6 77.42,65.6 U$2.17
N$41
  Top 0.203: U$2.19 74.98,66.01 74.17,66.01 72.34,64.18 69.09,64.18 68.48,63.57 67.26,63.57 60.76,57.07 46.94,57.07 38.2,65.81 38.2,78.4 JP2.4
N$42
  Top 0.203: U$2.21 72.34,66.41 71.73,66.41 70.31,64.99 68.68,64.99 68.07,64.38 66.85,64.38 60.35,57.88 47.35,57.88 43.48,61.74 43.48,75.76 40.84,78.4 JP2.3
N$43
  Top 0.203: U$2.23 69.9,66.82 69.29,66.82 67.67,65.19 66.45,65.19 59.94,58.69 47.75,58.69 44.3,62.15 44.3,77.39 43.28,78.4 JP2.2
N$44
  Top 0.203: U$2.25 67.26,67.23 59.54,59.51 48.16,59.51 45.92,61.74 45.92,78.4 JP2.1
N$45  (via drill 0.3)
  Top 0.203: v73.76,64.59 74.37,64.59 74.78,64.18 74.78,63.37 74.57,63.16 71.93,63.16 71.73,63.37 69.49,63.37 62.38,56.25 46.53,56.25 34.34,68.45 34.34,80.23 35.56,81.45 JP3.5
  Bottom 0.203: v73.76,64.59 73.76,66.62 74.57,67.43 75.79,67.43 76.61,68.24 77.83,68.24 U$2.18
N$46  (via drill 0.3)
  Top 0.203: v60.55,64.18 67.46,71.09 72.54,71.09 74.78,68.85 75.18,68.85 U$2.20
  Bottom 0.203: v60.55,64.18 60.55,60.52 59.54,59.51 48.16,59.51 39.42,68.24 39.42,80.23 38.2,81.45 JP3.4
N$47
  Top 0.203: U$2.22 72.95,69.06 72.95,67.84 73.76,67.02 73.76,66.21 72.14,64.59 68.89,64.59 68.28,63.98 67.06,63.98 60.55,57.47 47.14,57.47 43.08,61.54 43.08,74.54 40.44,77.18 40.23,77.18 39.42,78 39.42,80.23 40.64,81.45 JP3.3
N$48
  Top 0.203: U$2.24 70.51,69.26 70.51,68.04 71.12,67.43 71.12,66.41 70.31,65.6 68.68,65.6 67.87,64.79 66.65,64.79 60.15,58.29 47.55,58.29 43.89,61.94 43.89,76.17 41.86,78.2 41.86,80.23 43.08,81.45 JP3.2
N$49
  Top 0.203: U$2.26 67.87,69.67 67.87,68.65 68.68,67.84 68.68,66.82 67.87,66.01 66.65,66.01 59.74,59.1 47.95,59.1 45.52,61.54 45.52,76.98 44.5,78 44.5,80.23 45.72,81.45 JP3.1
N$77
  Top 0.305: RELAY.9 75.59,81.25 74.57,81.25 72.54,79.22 68.89,79.22 DF.A
  Top 0.406: Q1.3 64.5,79 68.7,79 DF.A
NC
  Bottom 0.406: RELAY.1 72.14,74.34 73.36,74.34 74.17,75.15 84.33,75.15 90.63,68.85 96.52,68.85 99.36,66.01 99.36,62.35 96.11,59.1 94.69,59.1 JP1.1
NO
  Bottom 0.406: RELAY.10 73.15,81.65 73.15,77.18 66.24,70.28 66.24,67.43 66.04,67.23 66.04,66.82 77.01,55.85 87.78,55.85 94.49,49.14 RLPORT.1
QH*  (via drill 0.41)
  Top 0.203: v73.4,37.2 73.4,43.2 72.4,44.2 72.4,45.5 74HC595.9
  Bottom 0.203: v73.4,37.2 73.4,30.5 77.4,26.5 78.8,26.5 89.5,15.8 89.5,11.8 90,11.3 90,9.3 91.1,8.2 91.1,7.2 EXTOUT1.7
RL  (via drill 0.3)
  Top 0.203: RQ.1 63.6,74.54 63.6,77.39 Q1.1 63.6,77.59 64.01,77.59 64.82,78.4 66.65,78.4 68.28,76.78 77.83,76.78 87.78,66.82 U$2.10 | v75.39,59.71 70.71,55.03 45.92,55.03 26.62,74.34 26.62,79.01 25.6,80.03 25.6,81.45 JP3.9
  Bottom 0.203: v75.39,59.71 81.69,59.71 86.36,64.38 86.36,65.19 87.78,66.62 U$2.10
RS  (via drill 0.3)
  Top 0.203: v95.71,55.24 99.36,51.58 99.36,21.51 97.13,19.27 97.13,4.03 RP.1 | v51,54.43 71.12,54.43 v75.39,58.69
  Top 0.406: RP.1 97,2.6 96.9,2.5 93.1,2.5 93,2.6 RR.2
  Bottom 0.203: 92.25,58.69 91.24,59.71 91.24,65.81 90.63,66.41 U$2.8 | 92.25,58.69 v95.71,55.24 | v51,54.43 29.26,76.17 29.26,79.01 28.45,79.83 25.4,79.83 23.77,81.45 22.96,81.45 JP3.10 | 92.25,58.69 v75.39,58.69
SCL  (via drill 0.3)
  Top 0.203: U$2.5 92.66,63.57 94.28,65.19 94.28,66.62 93.27,67.63 90.02,67.63 89.2,66.82 89.2,66.41 88.39,65.6 87.17,65.6 86.36,64.79 86.36,56.05 77.01,46.7 77.01,44.88 78.44,43.45 78.44,42.03 DS1307.6 78.44,41.83 78.44,41.22 77.62,40.41 75.59,40.41 74.17,41.83 74.17,46.09 69.49,50.77 v47.14,50.77 | v95.3,44.88 95.3,43.25 PCF8591.10
  Bottom 0.203: v95.3,44.88 95.3,47.11 96.32,48.13 96.32,55.65 94.28,57.68 93.88,57.68 92.66,58.9 92.66,63.37 U$2.5 | v47.14,50.77 20.52,77.39 20.52,78.4 JP2.11
SDA  (via drill 0.3)
  Top 0.203: v83.72,42.03 79.86,42.03 DS1307.5 | v94.69,45.48 95.71,45.48 96.32,44.88 96.32,43.25 PCF8591.9 | v87.99,54.43 94.89,61.33 94.89,63.16 U$2.3 | v75.39,52.8 v43.48,52.8
  Bottom 0.203: v83.72,42.03 84.94,42.03 85.55,42.64 | 87.99,45.08 88.39,45.48 v94.69,45.48 | 87.99,45.08 85.55,42.64 | 87.99,45.08 v87.99,54.43 | v43.48,52.8 17.88,78.4 JP2.12 | 85.55,42.64 v75.39,52.8
VCC  (via drill 0.3)
  Top 0.203: 63.2,45.89 61.57,45.89 C3.1 | 63.2,45.89 63.4,45.69 74HC595.16 | 64.21,46.91 67.67,50.36 69.29,50.36 69.9,49.75 69.9,48.53 ROE.2 70.1,48.33 70.1,47.31 71.12,46.3 71.12,45.69 74HC595.10 71.32,45.48 71.73,45.08 v71.73,44.06 | 64.21,46.91 63.2,45.89 | 64.21,46.91 v46.94,46.91 | JP6.4 91.03,27.6 91.03,25.16 JP6.3 | 86.77,43.86 87.38,43.25 PCF8591.16 87.38,43.05 v86.56,42.23 | 86.77,43.86 86.16,44.47 85.14,44.47 C5.1 | 89.2,45.48 90.02,44.67 90.02,43.25 PCF8591.14 | 89.2,45.48 88.39,45.48 86.77,43.86 | 89.2,45.48 89.2,50.77 97.54,59.1 97.54,62.76 U$2.1
  Top 0.406: EXTOUT1.8 93.7,7.1 93.7,6.8 95.1,5.4 95.1,4 RP.2
  Bottom 0.203: EXTOUT1.8 93.6,7.2 92.5,8.3 92.5,15 90.9,16.6 90.9,20 JP6.1 90.9,20.1 91.1,20.3 91.1,22.5 JP6.2 91.1,22.6 90.9,22.8 90.9,25 JP6.3 | JP6.5 90.9,30.1 90.9,27.9 91.1,27.7 JP6.4 91.24,27.81 92.25,27.81 92.86,28.42 92.86,31.87 86.56,38.17 86.56,41.42 | v46.94,46.91 15.44,78.4 JP2.13 | v86.56,42.23 86.56,41.42 | 86.56,41.42 76.61,41.42 73.97,44.06 v71.73,44.06
VIN  (via drill 0.3)
  Top 0.305: DF.C 68.89,75.15 71.32,75.15 71.73,75.56 72.95,75.56 74.57,73.93 RELAY.2 74.78,73.73 74.78,71.09 76.61,69.26 76.61,66.82 76.4,66.62 76.4,66.41 76.2,66.21 76.2,45.89 C4.1 | JP3.13 15.44,81.65 17.68,81.65 JP3.12 | v63.8,11.14 66.65,8.3 F2.2 | v74.98,42.03 75.79,42.03 DS1307.8 | v64.62,42.03 v71.73,42.03 | U$2.4 95.5,65.6 97.74,65.6 97.94,65.4 U$2.2
  Top 0.406: D3.C 79.3,11.8 77.8,10.3 | 77.8,10.3 74.9,7.4 68.8,7.4 68.1,8.1 66.7,8.1 F2.2 | LED.A 79.6,8.5 77.8,10.3 | C4.1 76,42 DS1307.8
  Bottom 0.305: 63.7,41.12 63.8,41.01 v63.8,11.14 | 63.7,41.12 59.94,44.88 46.94,44.88 13.82,78 13.82,79.01 15.24,80.44 15.24,81.45 JP3.13 | v71.73,42.03 v74.98,42.03 | 63.7,41.12 v64.62,42.03 | U$2.4 95.3,65.81 92.86,68.24 86.16,68.24 80.67,73.73 74.78,73.73 RELAY.2
VIN_PRE
  Top 0.406: C0.1 57.4,16.5 57.9,16 57.9,15 60.7,12.2 C2.+ 60.8,12.1 66.7,12.1 F2.1
  Top 0.508: L1.2 12,11.19 L1'.2 14.2,9.1 16,7.3 24.8,7.3 27.3,9.8 LM2596.4
  Bottom 0.305: C2.+ 60.55,12.16 60.55,10.33 57.1,6.88 57.1,3.02 54.86,0.78 22.35,0.78 14.02,9.11 L1'.2

### Text on the board
tNames: +5V | 3V3 | P1 | OSPi v1.4 | pi.opensprinkler.com | OSPi v1.4 | pi.opensprinkler.com | NC | CO | NO | TVS1-8 | A0 A1 A2 A3 OUT | GND | VCC | S1-8
bNames: A0 A1 A2 A3 OUT | GND | VCC